# EAGLE schematic modulo_luz (EAGLE 8.3.1)
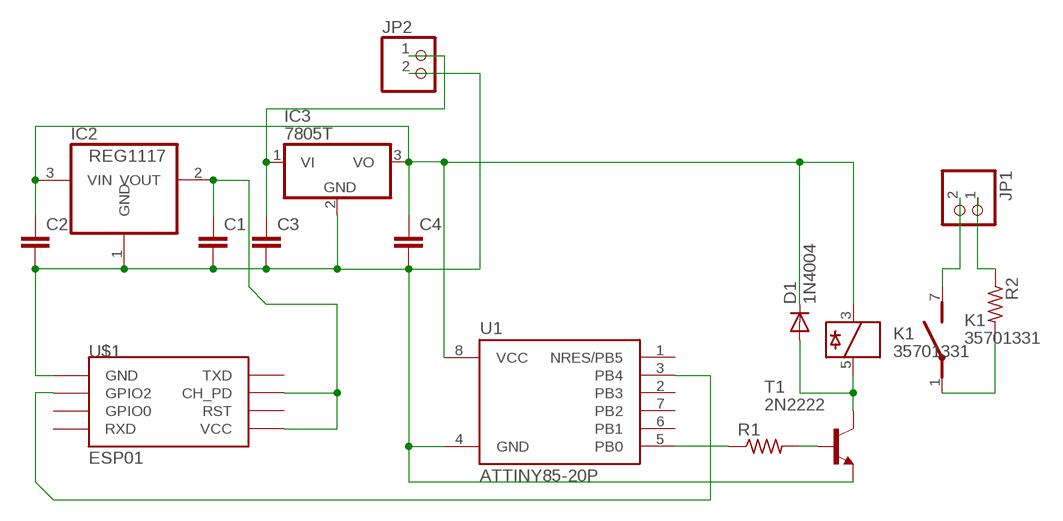
[diagram p0: schematic, sheet 1]

## Parts
C1  C2,5-3  [C2.5-3]
C2  C2,5-3  [C2.5-3]
C3  C2,5-3  [C2.5-3]
C4  C2,5-3  [C2.5-3]
D1  1N4004  [DO41-10]
IC2  REG1117  [SOT223]
IC3  7805T  [TO220H]
JP1  PINHD-1X2  [1X02]
JP2  PINHD-1X2  [1X02]
K1  35701331  [REED]
R1  R-US_0204/2V  [0204V]
R2  R-US_0204/2V  [0204V]
T1  2N2222  [TO92-EBC-OVAL]
U1  ATTINY85-20P  [PDIP08_300MIL]
U$1  ESP01  [ESP01]

## Nets
N$1: C1.1 IC2.2(VOUT) U$1.CH_PD U$1.VCC
N$2: C3.1 IC3.1(VI) JP2.1
N$3: R1.2 T1.B
N$4: R1.1 U1.5(PB0)
N$5: D1.A K1.5 T1.C
N$6: U1.3(PB4) U$1.GPIO2
N$7: K1.1(2:P) R2.2
N$8: JP1.1 R2.1
N$9: JP1.2 K1.7(2:S)
N$10: C2.1 C4.1 D1.C IC2.3(VIN) IC3.3(VO) K1.3 U1.8(VCC)
N$16: C1.2 C2.2 C3.2 C4.2 IC2.1(GND) IC3.2(GND) JP2.2 T1.E U1.4(GND) U$1.GND
Unconnected: U1.1(NRES/PB5) U1.2(PB3) U1.6(PB1) U1.7(PB2) U$1.GPIO0 U$1.RST U$1.RX(RXD) U$1.TX(TXD)

## Library data of the parts
C1-C4 = capacitor-wima:C: CAPACITOR naming: grid - package width
D1 = adafruit:1N4004: DIODE General purpose 1N400x type rectifier (With bigger pads) http://www.ladyada.net/library/pcb/eaglelibrary.html
IC2 = burr-brown:REG1117: 800mA and 1A Low Dropout (LDO) Positive Regulator 1.8V, 2.5V, 2.85V, 3.3V, 5V, and Adj; MPN: REG1117; OC_FARNELL: 1097566; OC_NEWARK: 14P6981
IC3 = linear:78*: Positive VOLTAGE REGULATOR Source: http://cache.national.com/ds/LM/LM78L05.pdf http://www.fairchildsemi.com/ds/LM/LM7805.pdf
JP1 JP2 = pinhead:PINHD-1X2: PIN HEADER
K1 = relay:35701331: RELAY reed, 1 x norm. open with polarity; OC_FARNELL: unknown; OC_NEWARK: unknown
R1 R2 = resistor:R-US_: RESISTOR, American symbol
T1 = adafruit:2N2222: NPN TRANSISTOR Big oval pads
U1 = _hhn_attiny25_45_85:ATTINY85*: ATMEL ATtiny 85 Packages: P = PDIP 08 30mil S = SOIC 08 EIAJ 208mil Technologies Note: for complete ordering code (temp. range, finish, tape&reel etc.) see www.atmel.com • Supply Voltage: V = (1.8…5.5)V | [blank] = (2.7…5.5)V • Speed: 10 = 10 MHz | 20 = 20 MHz Author: Dipl.-Ing. FH Rainer Bayer HHN Hochschule Heilbronn (Heilbronn University), rainer.bayer@hs-heilbronn.de Ingenieurbüro ing-rb, mail@ing-rb.de
U$1 = esp8266modules:ESP01: ESP8266 Wifi module 01